# EasyEDA schematic SCH_meater2_2025-10-20.json
TITLE: meater version 2 reviewed; REV: 1.0; Date: 2025-09-25; Sheet: 1/1; Drawn By: Christlight; Company: Your Company
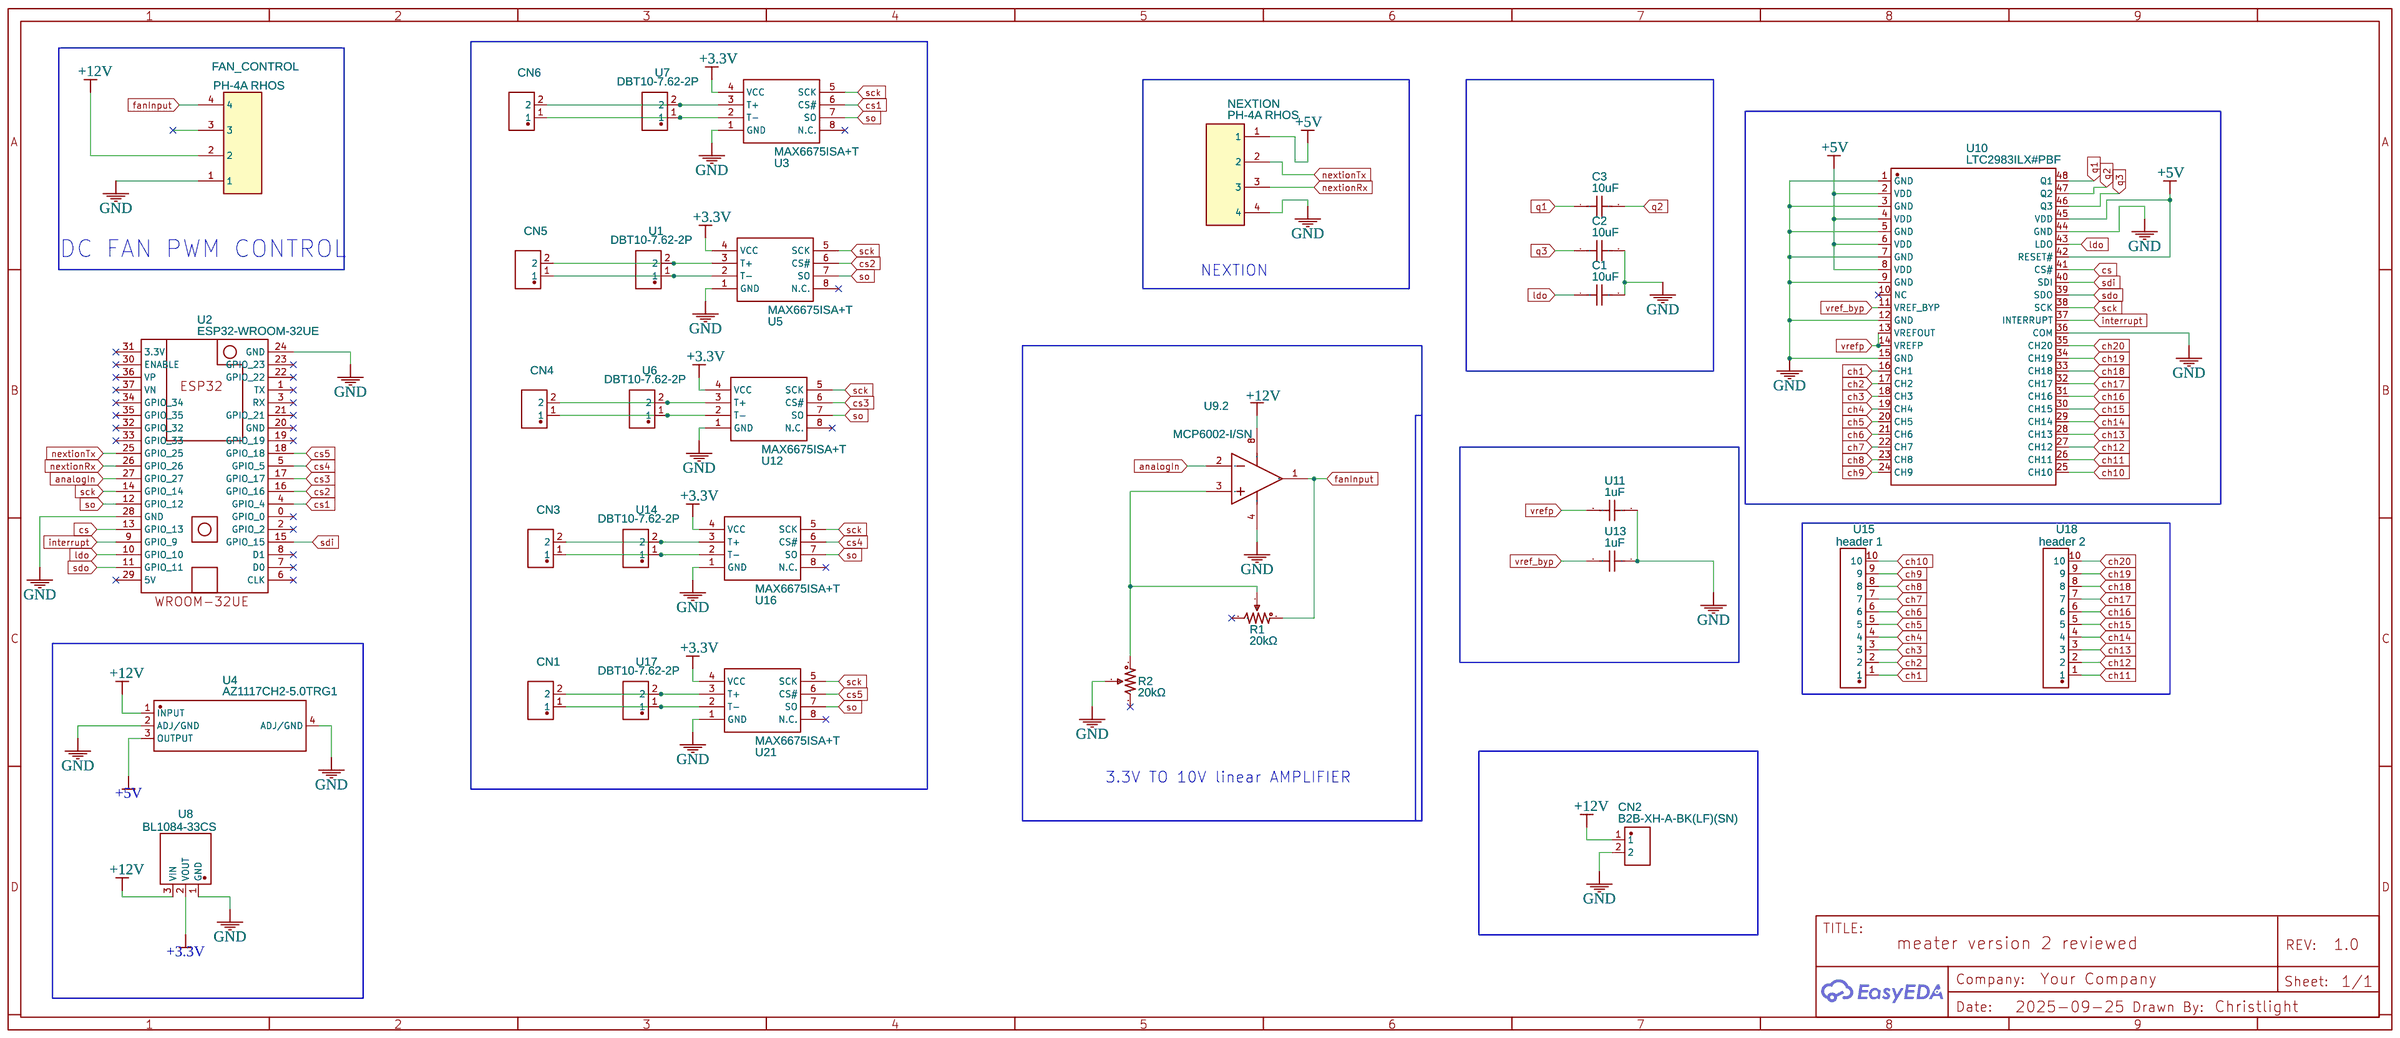
[diagram p0: schematic sheet]

## Parts
C1  10uF  [C0805]
C2  10uF  [C0805]
C3  10uF  [C0805]
CN1  B2B-XH-A-BK(LF)(SN)  [CONN-TH_2P-P2.50_JST_B2B-XH-A-M]
CN2  B2B-XH-A-BK(LF)(SN)  [CONN-TH_2P-P2.50_JST_B2B-XH-A-M]
CN3  B2B-XH-A-BK(LF)(SN)  [CONN-TH_2P-P2.50_JST_B2B-XH-A-M]
CN4  B2B-XH-A-BK(LF)(SN)  [CONN-TH_2P-P2.50_JST_B2B-XH-A-M]
CN5  B2B-XH-A-BK(LF)(SN)  [CONN-TH_2P-P2.50_JST_B2B-XH-A-M]
CN6  B2B-XH-A-BK(LF)(SN)  [CONN-TH_2P-P2.50_JST_B2B-XH-A-M]
FAN_CONTROL  PH-4A RHOS  [CONN-TH_PH-4A]
NEXTION  PH-4A RHOS  [CONN-TH_PH-4A]
R1  20kΩ  [RES-ADJ-TH_3296X]
R2  20kΩ  [RES-ADJ-TH_3296X]
U1  DBT10-7.62-2P  [CONN-TH_2P-P7.62_DBT10-7.62-2P]
U2  ESP32-WROOM-32UE  [ESP32-WROOM-32UE]
U3  MAX6675ISA+T  [SOIC-8_L5.0-W4.0-P1.27-LS6.0-BL]
U4  AZ1117CH2-5.0TRG1  [SOT-223_L6.5-W3.5-P2.30-LS7.0-BR]
U5  MAX6675ISA+T  [SOIC-8_L5.0-W4.0-P1.27-LS6.0-BL]
U6  DBT10-7.62-2P  [CONN-TH_2P-P7.62_DBT10-7.62-2P]
U7  DBT10-7.62-2P  [CONN-TH_2P-P7.62_DBT10-7.62-2P]
U8  BL1084-33CS  [TO-263-2_L10.1-W9.1-P5.08-LS15.2-TL]
U9  MCP6002-I/SN  [SOIC-8_L4.9-W3.9-P1.27-LS6.0-BL]  (section 2)
U10  LTC2983ILX#PBF  [LQFP-48_L7.0-W7.0-P0.50-LS9.0-BL]
U11  1uF  [C0603]
U12  MAX6675ISA+T  [SOIC-8_L5.0-W4.0-P1.27-LS6.0-BL]
U13  1uF  [C0603]
U14  DBT10-7.62-2P  [CONN-TH_2P-P7.62_DBT10-7.62-2P]
U15  header 1  [CONN-TH_10P-P2.54_KF128-2.54-10P]
U16  MAX6675ISA+T  [SOIC-8_L5.0-W4.0-P1.27-LS6.0-BL]
U17  DBT10-7.62-2P  [CONN-TH_2P-P7.62_DBT10-7.62-2P]
U18  header 2  [CONN-TH_10P-P2.54_KF128-2.54-10P]
U21  MAX6675ISA+T  [SOIC-8_L5.0-W4.0-P1.27-LS6.0-BL]

## Library data of the parts
C1-C3 = GRT21BC71E106KE13L: Contributor: lcsc; Supplier: LCSC; Supplier Part: C882505; Manufacturer: muRata(村田); JLCPCB Part Class: Extended Part
CN1-CN6 = B2B-XH-A-BK(LF)(SN): Supplier: LCSC; Supplier Part: C378939; Manufacturer: JST; JLCPCB Part Class: Extended Part; Contributor: lcsc
FAN_CONTROL NEXTION = PH-4A RHOS: Supplier: LCSC; Manufacturer: BOOMELE(博穆精密); Manufacturer Part: PH-4A; Supplier Part: C2321; JLCPCB Part Class: Extended Part
R1 R2 = 3296X-1-203_C48997920: Supplier: LCSC; Supplier Part: C48997920; Manufacturer: JIERR(捷而瑞); Manufacturer Part: 3296X-1-203; JLCPCB Part Class: Extended Part; Contributor: lcsc
U1 U6 U7 U14 U17 = DBT10-7.62-2P: Contributor: LCSC; Supplier: LCSC; Supplier Part: C395930; Manufacturer: DORABO(地博电气); Manufacturer Part: DBT10-7.62-2P-GN-P; JLCPCB Part Class: Extended Part
U2 = ESP32-WROOM-32UE: link: https://www.mouser.bg/ProductDetail/Espressif-Systems/ESP32-DevKitC-32UE?qs=GedFDFLaBXFguOYDKoZ3jA%3D%3D; Contributor: MehmetBAL
U3 U5 U12 U16 U21 = MAX6675ISA+T: Supplier: LCSC; Manufacturer: ADI(亚德诺)/MAXIM(美信); Supplier Part: C16030; JLCPCB Part Class: Extended Part
U4 = AZ1117CH2-5.0TRG1: Contributor: lcsc; Supplier: LCSC; Supplier Part: C3003063; Manufacturer: DIODES(美台); JLCPCB Part Class: Extended Part
U8 = BL1084-33CS: Contributor: lcsc; Supplier: LCSC; Supplier Part: C2932501; Manufacturer: BL(上海贝岭); JLCPCB Part Class: Extended Part
U9 = MCP6002-I/SN: Operating Temperature: -40°C ~ 85°C; subpart_no: 2; Supplier Part: C116706; Supplier: LCSC; Manufacturer: MICROCHIP(美国微芯); JLCPCB Part Class: Extended Part
U10 = LTC2983ILX#PBF: Contributor: LCSC; Supplier: LCSC; Supplier Part: C427448; Manufacturer: ADI(亚德诺); JLCPCB Part Class: Extended Part
U11 U13 = CGA3E1X7R1E105MT0Y0E: Contributor: lcsc; Supplier: LCSC; Supplier Part: C5119330; Manufacturer: TDK; JLCPCB Part Class: Extended Part
U15 U18 = KF128-2.54-10P: Contributor: LCSC; Supplier: LCSC; Supplier Part: C474928; Manufacturer: KEFA(科发); JLCPCB Part Class: Extended Part

## Nets
+3.3V: U3.4(VCC) U5.4(VCC) U8.2(VOUT) U12.4(VCC) U16.4(VCC) U21.4(VCC)
+5V: NEXTION.1 U4.3(OUTPUT) U10.2(VDD) U10.4(VDD) U10.6(VDD) U10.8(VDD) U10.42(RESET#) U10.45(VDD)
+12V: CN2.1 FAN_CONTROL.2 U4.1(INPUT) U8.3(VIN) U9.8(VDD)
GND: C1.2 C2.2 CN2.2 FAN_CONTROL.1 NEXTION.4 R2.2 U2.24(GND) U2.28(GND) U3.1(GND) U4.2(ADJ/GND) U4.4(ADJ/GND) U5.1(GND) U8.1(GND) U9.4(VSS) U10.1(GND) U10.3(GND) U10.5(GND) U10.7(GND) U10.9(GND) U10.12(GND) U10.15(GND) U10.36(COM) U10.44(GND) U11.1 U12.1(GND) U13.1 U16.1(GND) U21.1(GND)
analogIn: U2.27(GPIO 27) U9.2(VINA-)
ch1: U10.16(CH1) U15.1
ch2: U10.17(CH2) U15.2
ch3: U10.18(CH3) U15.3
ch4: U10.19(CH4) U15.4
ch5: U10.20(CH5) U15.5
ch6: U10.21(CH6) U15.6
ch7: U10.22(CH7) U15.7
ch8: U10.23(CH8) U15.8
ch9: U10.24(CH9) U15.9
ch10: U10.25(CH10) U15.10
ch11: U10.26(CH11) U18.1
ch12: U10.27(CH12) U18.2
ch13: U10.28(CH13) U18.3
ch14: U10.29(CH14) U18.4
ch15: U10.30(CH15) U18.5
ch16: U10.31(CH16) U18.6
ch17: U10.32(CH17) U18.7
ch18: U10.33(CH18) U18.8
ch19: U10.34(CH19) U18.9
ch20: U10.35(CH20) U18.10
cs: U2.13(GPIO 13) U10.41(CS#)
cs1: U2.4(GPIO 4) U3.6(CS#)
cs2: U2.16(GPIO 16) U5.6(CS#)
cs3: U2.17(GPIO 17) U12.6(CS#)
cs4: U2.5(GPIO 5) U16.6(CS#)
cs5: U2.18(GPIO 18) U21.6(CS#)
fanInput: FAN_CONTROL.4 R1.1 U9.1(VOUTA)
interrupt: U2.9(GPIO 9) U10.37(INTERRUPT)
ldo: C1.1 U2.10(GPIO 10) U10.43(LDO)
nextionRx: NEXTION.3 U2.26(GPIO 26)
nextionTx: NEXTION.2 U2.25(GPIO 25)
q1: C3.1 U10.48(Q1)
q2: C3.2 U10.47(Q2)
q3: C2.1 U10.46(Q3)
sck: U2.14(GPIO 14) U3.5(SCK) U5.5(SCK) U10.38(SCK) U12.5(SCK) U16.5(SCK) U21.5(SCK)
sdi: U2.15(GPIO 15) U10.40(SDI)
sdo: U2.11(GPIO 11) U10.39(SDO)
so: U2.12(GPIO 12) U3.7(SO) U5.7(SO) U12.7(SO) U16.7(SO) U21.7(SO)
vref_byp: U10.11(VREF_BYP) U13.2
vrefp: U10.13(VREFOUT) U10.14(VREFP) U11.2
Net-(CN1-1): CN1.1 U17.1 U21.2(T-)
Net-(CN1-2): CN1.2 U17.2 U21.3(T+)
Net-(CN3-1): CN3.1 U14.1 U16.2(T-)
Net-(CN3-2): CN3.2 U14.2 U16.3(T+)
Net-(CN4-1): CN4.1 U6.1 U12.2(T-)
Net-(CN4-2): CN4.2 U6.2 U12.3(T+)
Net-(CN5-1): CN5.1 U1.1 U5.2(T-)
Net-(CN5-2): CN5.2 U1.2 U5.3(T+)
Net-(CN6-1): CN6.1 U3.2(T-) U7.1
Net-(CN6-2): CN6.2 U3.3(T+) U7.2
Net-(R1-2): R1.2 R2.1 U9.3(VINA+)

Not connected (* = marked no-connect by the designer): FAN_CONTROL 3; R1 3*; R2 3*; U2 0(GPIO 0)* 1(TX)* 2(GPIO 2)* 3(RX)* 6(CLK)* 7(D0)* 8(D1)* 19(GPIO 19)* 20(GND)* 21(GPIO 21)* 22(GPIO 22)* 23(GPIO 23)* 29(5V)* 30(ENABLE)* 31(3.3V)* 32(GPIO 32)* 33(GPIO 33)* 34(GPIO 34)* 35(GPIO 35)* 36(VP)* 37(VN)*; U3 8(N.C.)*; U5 8(N.C.)*; U10 10(NC)*; U12 8(N.C.)*; U16 8(N.C.)*; U21 8(N.C.)*

## Notes on the sheet
- DC FAN PWM CONTROL
- NEXTION
- 3.3V TO 10V linear AMPLIFIER
